# EAGLE design SplitFlap (EAGLE 7.4.0)
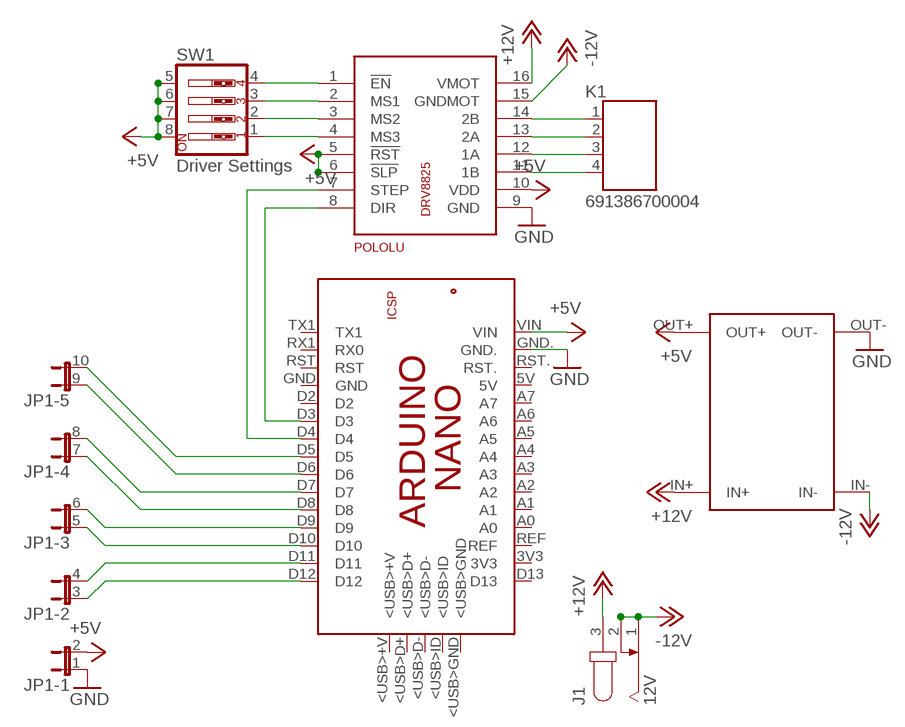
[diagram p0: schematic, sheet 1]

## Parts
J1  12V  JACK-PLUG0  [SPC4077]
JP1  JP5QE  [JP5Q]
K1  691386700004  [691386700004]
LEIVIN  LEIVIN_PWR  [LEIVIN_PWR]
PCB1  ARDUINO_NANO  [ARDUINO_NANO]
POLOLU  DRV8825  [DIP16]
SW1  Driver Settings  SW_DIP-4  [EDG-04]

## Nets
+5V: JP1.2 LEIVIN.OUT+ PCB1.VIN POLOLU.5(!RST!) POLOLU.6(!SLP!) POLOLU.10(VDD) SW1.5 SW1.6 SW1.7 SW1.8
+12V: J1.3 LEIVIN.IN+ POLOLU.16(VMOT)
-12V: J1.1 J1.2 LEIVIN.IN- POLOLU.15(GNDMOT)
GND: JP1.1 LEIVIN.OUT- PCB1.GND. POLOLU.9(GND)
N$1: POLOLU.1(!EN!) SW1.4
N$2: POLOLU.2(MS1) SW1.3
N$3: POLOLU.3(MS2) SW1.2
N$4: POLOLU.4(MS3) SW1.1
N$5: PCB1.D3 POLOLU.8(DIR)
N$6: PCB1.D4 POLOLU.7(STEP)
N$7: K1.1 POLOLU.14(2B)
N$8: K1.2 POLOLU.13(2A)
N$9: K1.3 POLOLU.12(1A)
N$10: K1.4 POLOLU.11(1B)
N$11: JP1.10 PCB1.D5
N$12: JP1.9 PCB1.D6
N$13: JP1.8 PCB1.D7
N$14: JP1.7 PCB1.D8
N$15: JP1.6 PCB1.D9
N$16: JP1.5 PCB1.D10
N$17: JP1.4 PCB1.D11
N$18: JP1.3 PCB1.D12
Unconnected: PCB1.3V3 PCB1.5V PCB1.5V. PCB1.<USB>+V PCB1.<USB>D+ PCB1.<USB>D- PCB1.<USB>GND PCB1.<USB>ID PCB1.A0 PCB1.A1 PCB1.A2 PCB1.A3 PCB1.A4 PCB1.A5 PCB1.A6 PCB1.A7 PCB1.D2 PCB1.D13 PCB1.GND PCB1.GND_ PCB1.MISO PCB1.MOSI PCB1.REF PCB1.RESET.. PCB1.RST PCB1.RST. PCB1.RX1(RX0) PCB1.SCK PCB1.TX1

## Library data of the parts
J1 = con-jack:JACK-PLUG: DC POWER JACK Power Jack, DC, Right Angle, Through Hole, Rated 5A at 16VDC, PC Terminals Distributor: Farnell (www.Farnell.de) Drawing: 84N1161.pdf / 84N1162.pdf Manufacturer: SPC Technology (www.spctechnology.com) Type: SPC4077 / SPC 4078; OC_FARNELL: unknown; OC_NEWARK: unknown
JP1 = jumper:JP5QE: JUMPER
K1 = Wurth_Elektronik_Electromechanic_Terminal_Blocks_Connectors_rev15d:691386700004: WR-TBL Terminal block - CUM5/4 - 4 Pins;=>Code : Con_TBL_Pluggable_5.00_6913867000xx_691386700004 <http://katalog.we-online.de/media/images/eican/Con_TBL_Pluggable_5.00_6913867000xx_pf2.jpg> Details see: http://katalog.we-online.de/em/datasheet/6913867000xx.pdf Created 11/3/2014, Karrer Zheng 2014 (C) Wurth Elektronik
LEIVIN = Havard.Fjaer.Custom:LEIVIN_PWR
PCB1 = E14_Arduino_revB:ARDUINO_NANO: Device for representing an Arduino Nano board with a footprint in an EAGLE design. Created by Dave Young for Element14. More EAGLE documentation at: http://www.element14.com/community/community/knode/cadsoft_eagle
POLOLU = Havard.Fjaer.Custom:DRV8825: POLOLU DRV8825 Read more <https://www.pololu.com/product/2133/>
SW1 = special:SW_DIP-4: DIP SWITCH

## Board
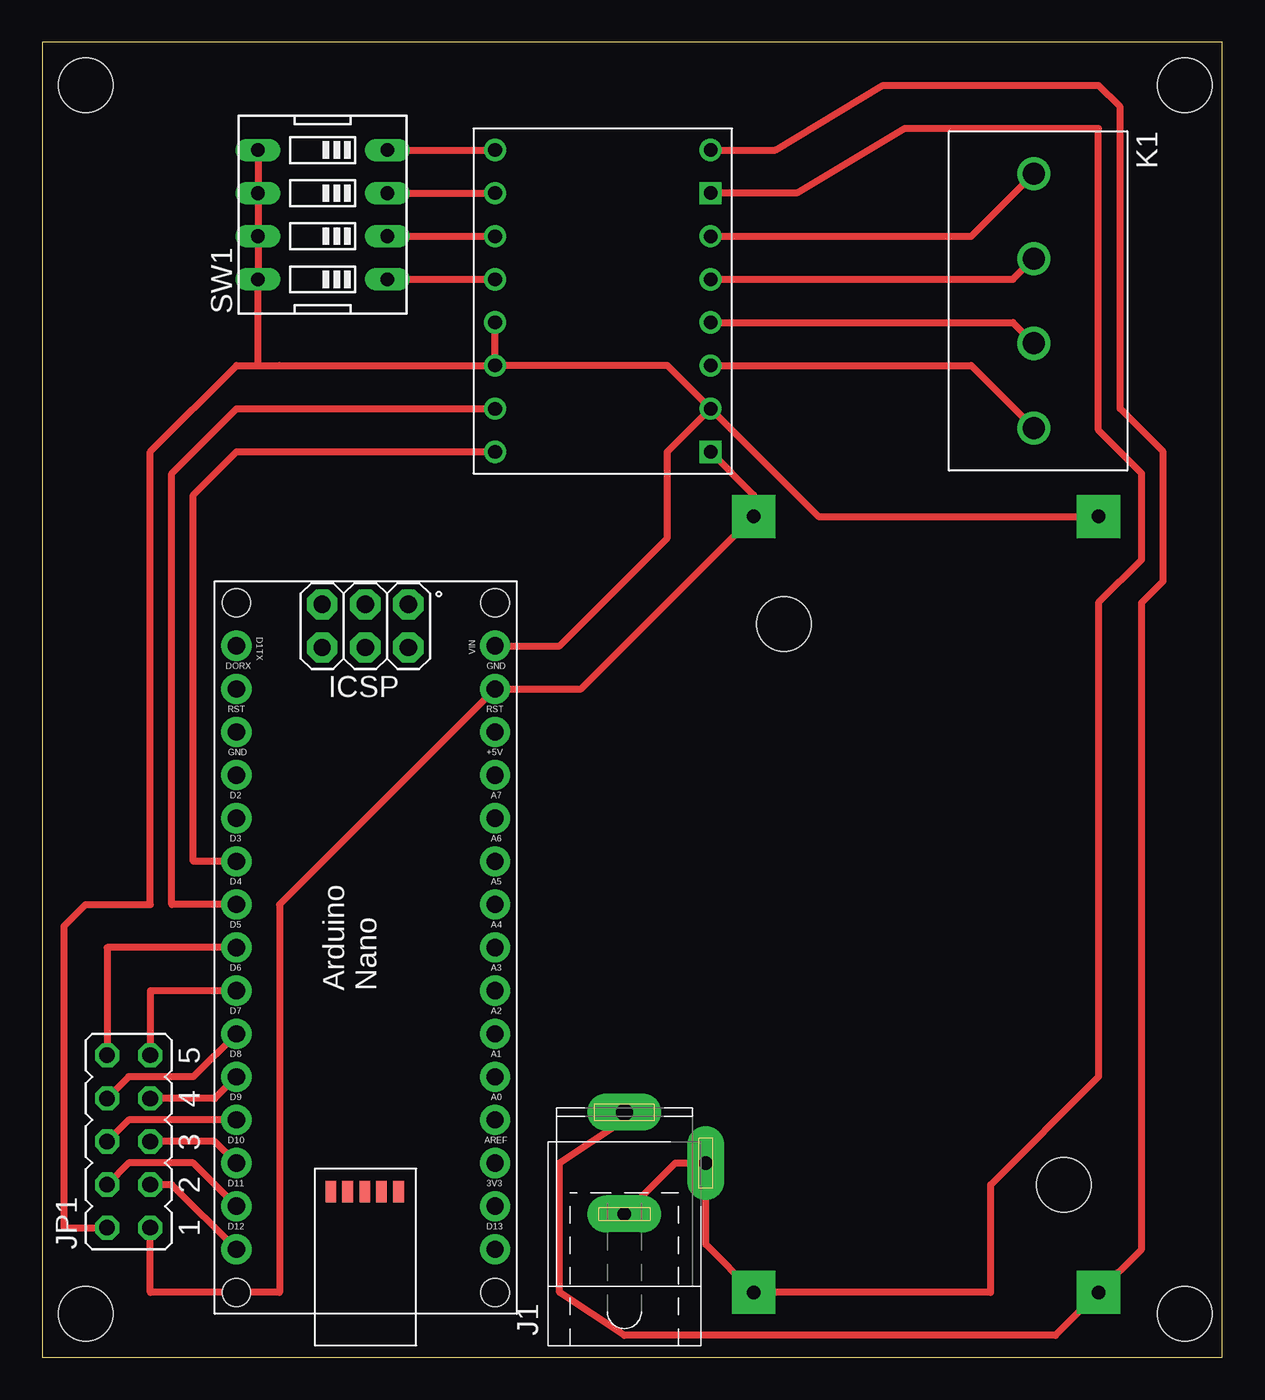
[diagram p1: board, top side]
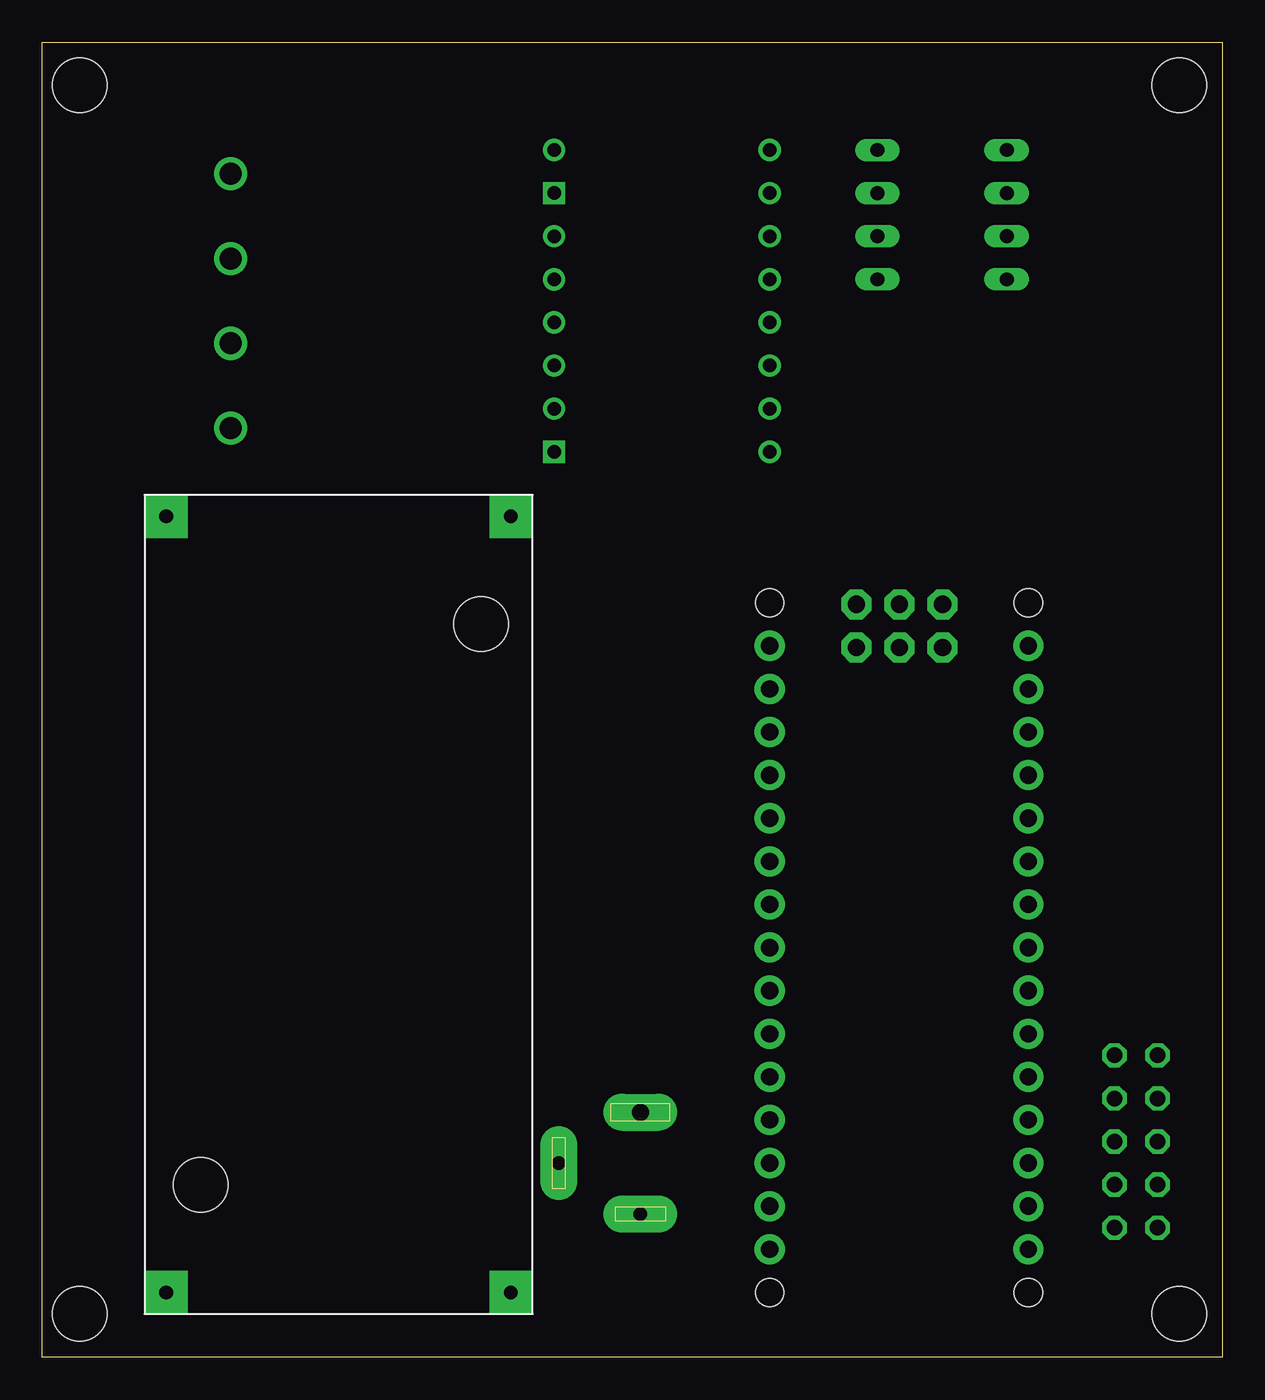
[diagram p2: board, bottom side, seen from below]

Size 69.52 x 77.46 mm. Coordinates in mm from the lower left corner, seen from the top.
Outline: 0,0 69.52,0 69.52,77.46 0,77.46 0,0
Copper layers (1*16): Top 0.035mm / dielectric 1.5mm / Bottom 0.035mm
Design rules "default *": minimum track width 10mil, minimum drill 24mil, track to track 8mil, track to pad 8mil, pad to pad 8mil, via to via 8mil, smd to smd 8mil, copper to edge 30mil, drill to drill 8mil, minimum pad ring 10mil, minimum via ring 8mil, stop-mask expansion 4mil, vias tented up to drill 0mil, thermal gap 10mil
Holes 3.2 mm at 2.54,2.54 67.31,2.54 67.31,74.93 2.54,74.93

### Footprints (pad centres in the part's own frame; a part is rotated, then mirrored left to right if it is on the bottom)
SPC4077 = drill 0.8 pad 2.184 long: 1 -3,0; 2 0,-4.8 | drill 1 pad 2.184 long: 3 3,0
JP5Q = drill 0.914 octagon: 1 -5.08,-1.27; 2 -5.08,1.27; 3 -2.54,-1.27; 4 -2.54,1.27; 5 0,-1.27; 6 0,1.27; 7 2.54,-1.27; 8 2.54,1.27; 9 5.08,-1.27; 10 5.08,1.27
691386700004 = drill 1.3: 1 -7.5,0; 2 -2.5,0; 3 2.5,0; 4 7.5,0
LEIVIN_PWR = drill 0.8 pad 2.54 square: IN+ -10.16,-22.86; IN- 10.16,-22.86; OUT+ -10.16,22.86; OUT- 10.16,22.86 | hole 3.2: -8.128,-16.51; 8.382,16.51
ARDUINO_NANO = drill 1.016 pad 1.778: 3V3 6.35,1.27; 5V 31.75,1.27; A0 11.43,1.27; A1 13.97,1.27; A2 16.51,1.27; A3 19.05,1.27; A4 21.59,1.27; A5 24.13,1.27; A6 26.67,1.27; A7 29.21,1.27; D2 29.21,16.51; D3 26.67,16.51; D4 24.13,16.51; D5 21.59,16.51; D6 19.05,16.51; D7 16.51,16.51; D8 13.97,16.51; D9 11.43,16.51; D10 8.89,16.51; D11 6.35,16.51; D12 3.81,16.51; D13 3.81,1.27; GND 31.75,16.51; GND. 36.83,1.27; REF 8.89,1.27; RST 34.29,16.51; RST. 34.29,1.27; RX1 36.83,16.51; TX1 39.37,16.51; VIN 39.37,1.27 | drill 1.016 pad 1.778 octagon: 5V. 39.268,6.375; GND_ 39.268,11.455; MISO 41.808,6.375; MOSI 39.268,8.915; RESET.. 41.808,11.455; SCK 41.808,8.915 | smd 1.27 x 0.635: <USB>+V 7.214,10.947; <USB>D+ 7.214,9.957; <USB>D- 7.214,8.941; <USB>GND 7.214,6.96; <USB>ID 7.214,7.976 | hole 1.651: 1.27,1.27; 1.27,16.51; 41.91,16.51; 41.91,1.27
DIP16 = drill 0.8: 1 -6.35,8.89; 2 -6.35,6.35; 3 -6.35,3.81; 4 -6.35,1.27; 5 -6.35,-1.27; 6 -6.35,-3.81; 7 -6.35,-6.35; 8 -6.35,-8.89; 10 6.35,-6.35; 11 6.35,-3.81; 12 6.35,-1.27; 13 6.35,1.27; 14 6.35,3.81; 16 6.35,8.89 | drill 0.8 square: 9 6.35,-8.89; 15 6.35,6.35
EDG-04 = drill 0.813 long: 1 -3.81,-3.81; 2 -1.27,-3.81; 3 1.27,-3.81; 4 3.81,-3.81; 5 3.81,3.81; 6 1.27,3.81; 7 -1.27,3.81; 8 -3.81,3.81

### Placement (x,y rotation side)
J1  34.29,11.43 90 top
JP1  5.08,12.7 90 top
K1  58.42,62.23 270 top
LEIVIN  52.07,26.67 0 bottom
PCB1  27.94,2.54 90 top
POLOLU  33.02,62.23 0 top
SW1  16.51,67.31 90 top

### Tracks (layer width: path | path; a pad name or v marks a point on that pad's centre or on a via)
+5V
  Top 0.406: SW1.5 SW1.6 SW1.7 SW1.8 12.7,58.42 | 12.7,58.42 13.97,58.42 POLOLU.6 | POLOLU.10 45.72,49.53 LEIVIN.OUT+ | PCB1.VIN 30.48,41.91 36.83,48.26 36.83,53.34 POLOLU.10 | POLOLU.10 36.83,58.42 POLOLU.6 | POLOLU.6 POLOLU.5 | JP1.2 1.27,7.62 1.27,25.4 2.54,26.67 6.35,26.67 6.35,53.34 11.43,58.42 12.7,58.42
+12V
  Top 0.406: J1.3 34.29,13.97 30.48,11.43 30.48,3.81 34.29,1.27 59.69,1.27 LEIVIN.IN+ 64.77,6.35 64.77,44.45 66.04,45.72 66.04,53.34 63.5,55.88 63.5,73.66 62.23,74.93 49.53,74.93 43.18,71.12 POLOLU.16
  Bottom 0.406: J1.3 33.83,13.97
-12V
  Top 0.406: J1.1 37.29,11.43 J1.2 39.09,6.63 LEIVIN.IN- 55.88,3.81 55.88,10.16 62.23,16.51 62.23,44.45 64.77,46.99 64.77,52.07 62.23,54.61 62.23,72.39 50.8,72.39 44.45,68.58 POLOLU.15
GND
  Top 0.406: POLOLU.9 41.91,50.8 LEIVIN.OUT- 31.75,39.37 PCB1.GND. 13.97,26.67 13.97,3.81 6.35,3.81 JP1.1
N$1
  Top 0.406: SW1.4 POLOLU.1
N$2
  Top 0.406: SW1.3 POLOLU.2
N$3
  Top 0.406: SW1.2 POLOLU.3
N$4
  Top 0.406: SW1.1 POLOLU.4
N$5
  Top 0.406: PCB1.D3 8.89,29.21 8.89,50.8 11.43,53.34 POLOLU.8
N$6
  Top 0.406: PCB1.D4 7.62,26.67 7.62,52.07 11.43,55.88 POLOLU.7
N$7
  Top 0.406: POLOLU.14 54.73,66.04 K1.1
N$8
  Top 0.406: POLOLU.13 57.19,63.5 K1.2
N$9
  Top 0.406: POLOLU.12 57.19,60.96 K1.3
N$10
  Top 0.406: POLOLU.11 54.73,58.42 K1.4
N$11
  Top 0.406: PCB1.D5 3.81,24.13 JP1.10
N$12
  Top 0.406: PCB1.D6 6.35,21.59 JP1.9
N$13
  Top 0.406: PCB1.D7 8.89,16.51 5.08,16.51 JP1.8
N$14
  Top 0.406: PCB1.D8 10.16,15.24 JP1.7
N$15
  Top 0.406: PCB1.D9 5.08,13.97 JP1.6
N$16
  Top 0.406: PCB1.D10 10.16,12.7 JP1.5
N$17
  Top 0.406: PCB1.D11 8.89,11.43 5.08,11.43 JP1.4
N$18
  Top 0.406: PCB1.D12 7.62,10.16 JP1.3